# Altium schematic sheet 08_ZYNQ_DDR.SchDoc
size A3; SheetNumber: 8; SheetTotal: 10
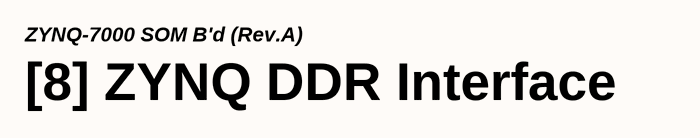
[diagram p0: 08_ZYNQ_DDR.SchDoc]

## Notes on the sheet
- ZYNQ-7000 SOM B'd (Rev.A)
- [8] ZYNQ DDR Interface
- Title
- Rev
- Doc
- Sheet #
- of
- Author
- This document is copyright of ArkX and shall not be revealed, produced, copied, in whole or in part,
- Date
- nor used for any purpose other than submitted.